# EAGLE schematic rionessl_tutorial (EAGLE 9.6.2)
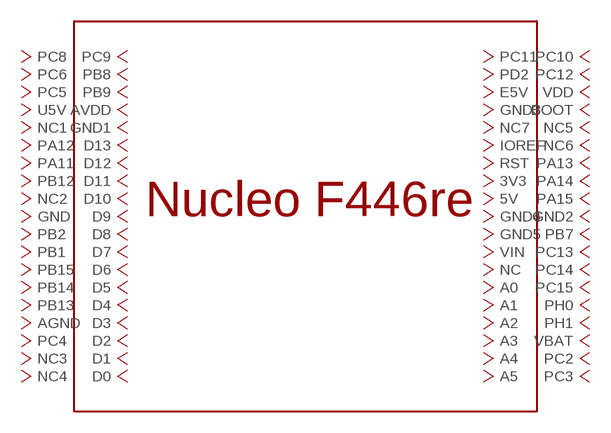
[diagram p0: schematic, sheet 1]

## Parts
U$1  446RE  [446RE]
Unconnected: U$1.3V3 U$1.5V U$1.A0 U$1.A1 U$1.A2 U$1.A3 U$1.A4 U$1.A5 U$1.AGND U$1.AVDD U$1.BOOT U$1.D0 U$1.D1 U$1.D2 U$1.D3 U$1.D4 U$1.D5 U$1.D6 U$1.D7 U$1.D8 U$1.D9 U$1.D10 U$1.D11 U$1.D12 U$1.D13 U$1.E5V U$1.GND U$1.GND1 U$1.GND2 U$1.GND3 U$1.GND4 U$1.GND5 U$1.IOREF U$1.NC1(NC) U$1.NC2(NC1) U$1.NC3(NC2) U$1.NC4(NC3) U$1.NC5(NC4) U$1.NC7(NC5) U$1.NC8(NC6) U$1.NC9(NC7) U$1.PA11 U$1.PA12 U$1.PA13 U$1.PA14 U$1.PA15 U$1.PB1 U$1.PB2 U$1.PB7 U$1.PB8 U$1.PB9 U$1.PB12 U$1.PB13 U$1.PB14 U$1.PB15 U$1.PC2 U$1.PC3 U$1.PC4 U$1.PC5 U$1.PC6 U$1.PC8 U$1.PC9 U$1.PC10 U$1.PC11 U$1.PC12 U$1.PC13 U$1.PC14 U$1.PC15 U$1.PD2 U$1.PH0 U$1.PH1 U$1.RST U$1.U5V U$1.VBAT U$1.VDD U$1.VIN

## Library data of the parts
U$1 = 446re:446RE: Nucleo F446RE